# Altium schematic sheet Top_DT.SchDoc
size A
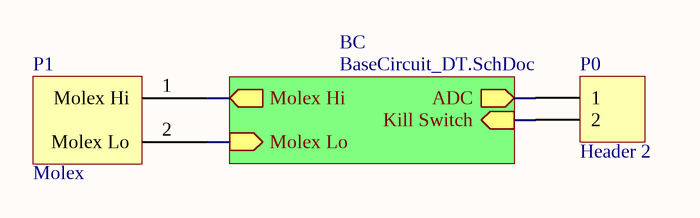
[diagram p0: Top_DT.SchDoc]

## Parts
P0  Header 2  [HDR1X2]
P1  Molex  [PCBComponent_1]

## Sub-sheets
BC = BaseCircuit_DT.SchDoc: ADC (out), Kill Switch (in), Molex Hi (out), Molex Lo (in)

## Nets
NetP0_1: P0.1 ; sheet BC/ADC
NetP0_2: P0.2 ; sheet BC/Kill Switch
NetP1_1: P1.1(Molex_Hi) ; sheet BC/Molex Hi
NetP1_2: P1.2(Molex_Lo) ; sheet BC/Molex Lo

## Library data of the parts
P0 = Header 2: Header, 2-Pin; LatestRevisionDate: 17-Jul-2002; LatestRevisionNote: Re-released for DXP Platform.; Publisher: Altium Limited
P1 = Component_1